# Altium schematic sheet Sheet_1_2026-05-31.schdoc
size 157 x 124 mm
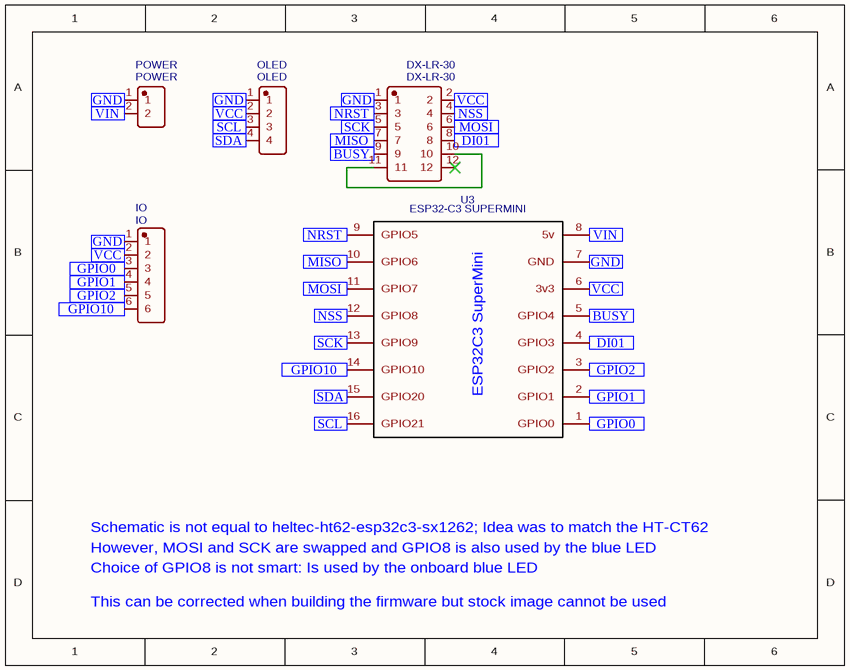
[diagram p0: Sheet_1_2026-05-31.schdoc]

## Parts
DX-LR-30  DX-LR-30  [HDR-TH_PM2.54-2X6PZZ-H8.5]
IO  IO  [HDR-TH_6P-P2.54-V-F-H3.5]
OLED  OLED  [HDR-TH_4P-P2.54-V-F]
POWER  POWER  [HDR-TH_2P-P2.54-V-F]
U3  ESP32-C3 SUPERMINI  [ESP32C3 SUPERMINI]

## Ports
BUSY (in), DI01 (in), GND (in), GPIO0 (in), GPIO1 (in), GPIO2 (in), GPIO10 (in), MISO (in), MOSI (in), NRST (in), NSS (in), SCK (in), SCL (in), SDA (in), VCC (in), VIN (in)

## Nets
BUSY: DX-LR-30.9 U3.5(GPIO4) ; port BUSY
DI01: DX-LR-30.8 U3.4(GPIO3) ; port DI01
GND: DX-LR-30.1 IO.1 OLED.1 POWER.1 U3.7(GND) ; port GND
GPIO0: IO.3 U3.1(GPIO0) ; port GPIO0
GPIO1: IO.4 U3.2(GPIO1) ; port GPIO1
GPIO2: IO.5 U3.3(GPIO2) ; port GPIO2
GPIO10: IO.6 U3.14(GPIO10) ; port GPIO10
MISO: DX-LR-30.7 U3.10(GPIO6) ; port MISO
MOSI: DX-LR-30.6 U3.11(GPIO7) ; port MOSI
NRST: DX-LR-30.3 U3.9(GPIO5) ; port NRST
NSS: DX-LR-30.4 U3.12(GPIO8) ; port NSS
SCK: DX-LR-30.5 U3.13(GPIO9) ; port SCK
SCL: OLED.3 U3.16(GPIO21) ; port SCL
SDA: OLED.4 U3.15(GPIO20) ; port SDA
VCC: DX-LR-30.2 IO.2 OLED.2 U3.6(3v3) ; port VCC
VIN: POWER.2 U3.8(5v) ; port VIN
NetDX-LR-30_10: DX-LR-30.10 DX-LR-30.11

Not connected (* = marked no-connect by the designer): DX-LR-30 12*

## Notes on the sheet
- Schematic is not equal to heltec-ht62-esp32c3-sx1262; Idea was to match the HT-CT62
- However, MOSI and SCK are swapped and GPIO8 is also used by the blue LED
- This can be corrected when building the firmware but stock image cannot be used
- Choice of GPIO8 is not smart: Is used by the onboard blue LED
- (in symbol ESP32-C3 SUPERMINI) ESP32C3 SuperMini

## Library data of the parts
DX-LR-30 = DX-LR-30: Manufacturer: SHOU HAN(首韩); Manufacturer Part: PM2.54-2x6PZZ-H8.5; Contributor: lcsc; Supplier: LCSC; Supplier Part: C54876742; JLCPCB Part Class: Extended Part; spicePre: U; spiceSymbolName: PM2.54-2X6PZZ-H8.5
IO = IO: Manufacturer: XKB Connectivity; Manufacturer Part: X6511FV-06-C85D32; Contributor: igelectronica; Package Display: No; Supplier: LCSC; Supplier Part: C718239; JLCPCB Part Class: Extended Part; spicePre: H; spiceSymbolName: X6511FV-06-C85D32
OLED = OLED: Manufacturer: ZHOURI(洲日); Manufacturer Part: PM2.54-1*4; Contributor: lcsc; Supplier: LCSC; Supplier Part: C5116530; JLCPCB Part Class: Extended Part; spicePre: H; spiceSymbolName: PM2.54-1*4
POWER = POWER: Manufacturer: XUNDA(讯答); Manufacturer Part: XDM254-1-02-Z-8.5-G0; Contributor: diego.martos.tavares; Supplier: LCSC; Supplier Part: C19268695; spicePre: U; spiceSymbolName: XDM254-1-02-Z-8.5-G0
U3 = ESP32-C3 SUPERMINI: Contributor: nomdetom; spicePre: U; spiceSymbolName: ESP32C3 SUPERMINI